# Altium schematic sheet MikroBus.SchDoc: Connecteur MikroBus
size Letter; ApprovedBy: Kevin Cotton; Author: Ing. Di Stefano; Organization: Cegep Limoilou; Address1: 1300, 8e Avenue; Address2: Québec, QC; Address3: Canada; Address4: G1J 5L5; Revision: A; SheetNumber: 3; SheetTotal: 5
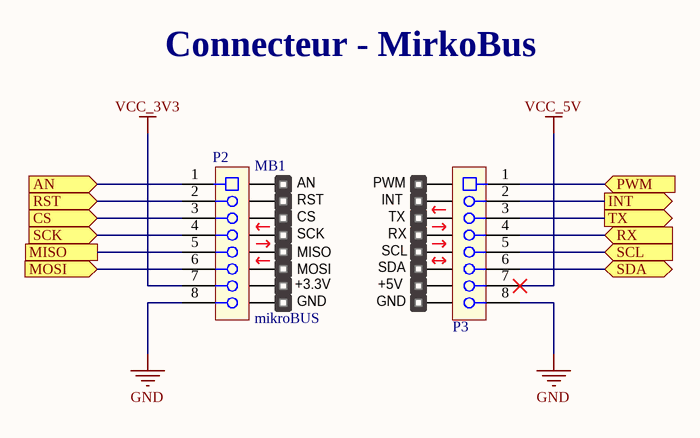
[diagram p0: MikroBus.SchDoc]

## Parts
MB1  mikroBUS  [mikroBUS-Large-No-Connector]  (no BOM)
P2  ESQ-108-14-T-S  [CONN_SKT_01X08_100MIL-ELEVATED-LONGPIN]  (value not drawn)
P3  ESQ-108-14-T-S  [CONN_SKT_01X08_100MIL-ELEVATED-LONGPIN]  (value not drawn)

## Ports
AN (in), CS (in), INT (out), MISO, MOSI (in), PWM (in), RST (in), RX (in), SCK (in), SCL (in), SDA (bidir), TX (out)

## Nets
GND: P2.8 P3.8
VCC_3V3: P2.7
VCC_5V: P3.7
AN: P2.1 ; port AN
CS: P2.3 ; port CS
INT: P3.2 ; port INT
MISO: P2.5 ; port MISO
MOSI: P2.6 ; port MOSI
PWM: P3.1 ; port PWM
RST: P2.2 ; port RST
RX: P3.4 ; port RX
SCK: P2.4 ; port SCK
SCL: P3.5 ; port SCL
SDA: P3.6 ; port SDA
TX: P3.3 ; port TX

Not connected (* = marked no-connect by the designer): MB1 1(AN) 2(RST) 3(CS) 4(SCK) 5(MISO) 6(MOSI) 7(3.3V) 8(GND) 9(GND) 10(5V) 11(SDA) 12(SCL) 13(TX) 14(RX) 15(INT) 16(PWM)

## Notes on the sheet
- Connecteur - MirkoBus
- Titre :
- Conception :
- Date :
- Approbation :
- Heure :
- Révision :
- Feuille
- de
- Fichier :
- (in symbol mikroBUS compatible add-on board) +3.3V; +5V

## Library data of the parts
MB1 = mikroBUS compatible add-on board
P2 P3 = CONN-100MIL-SKT-01X08_ELEVATED_LONGPIN: CONN SOCKET 8pos 100mils Elevated; Manufacturer 1: Samtec; Mounting Technology: TH; Manufacturer Part Number 1: ESQ-108-14-T-S; Supplier 1: Digikey; Supplier Part Number 1: SAM9303-ND